# Altium schematic sheet 海关全向控制器主控板电路V2_系统管理.SchDoc
size A4
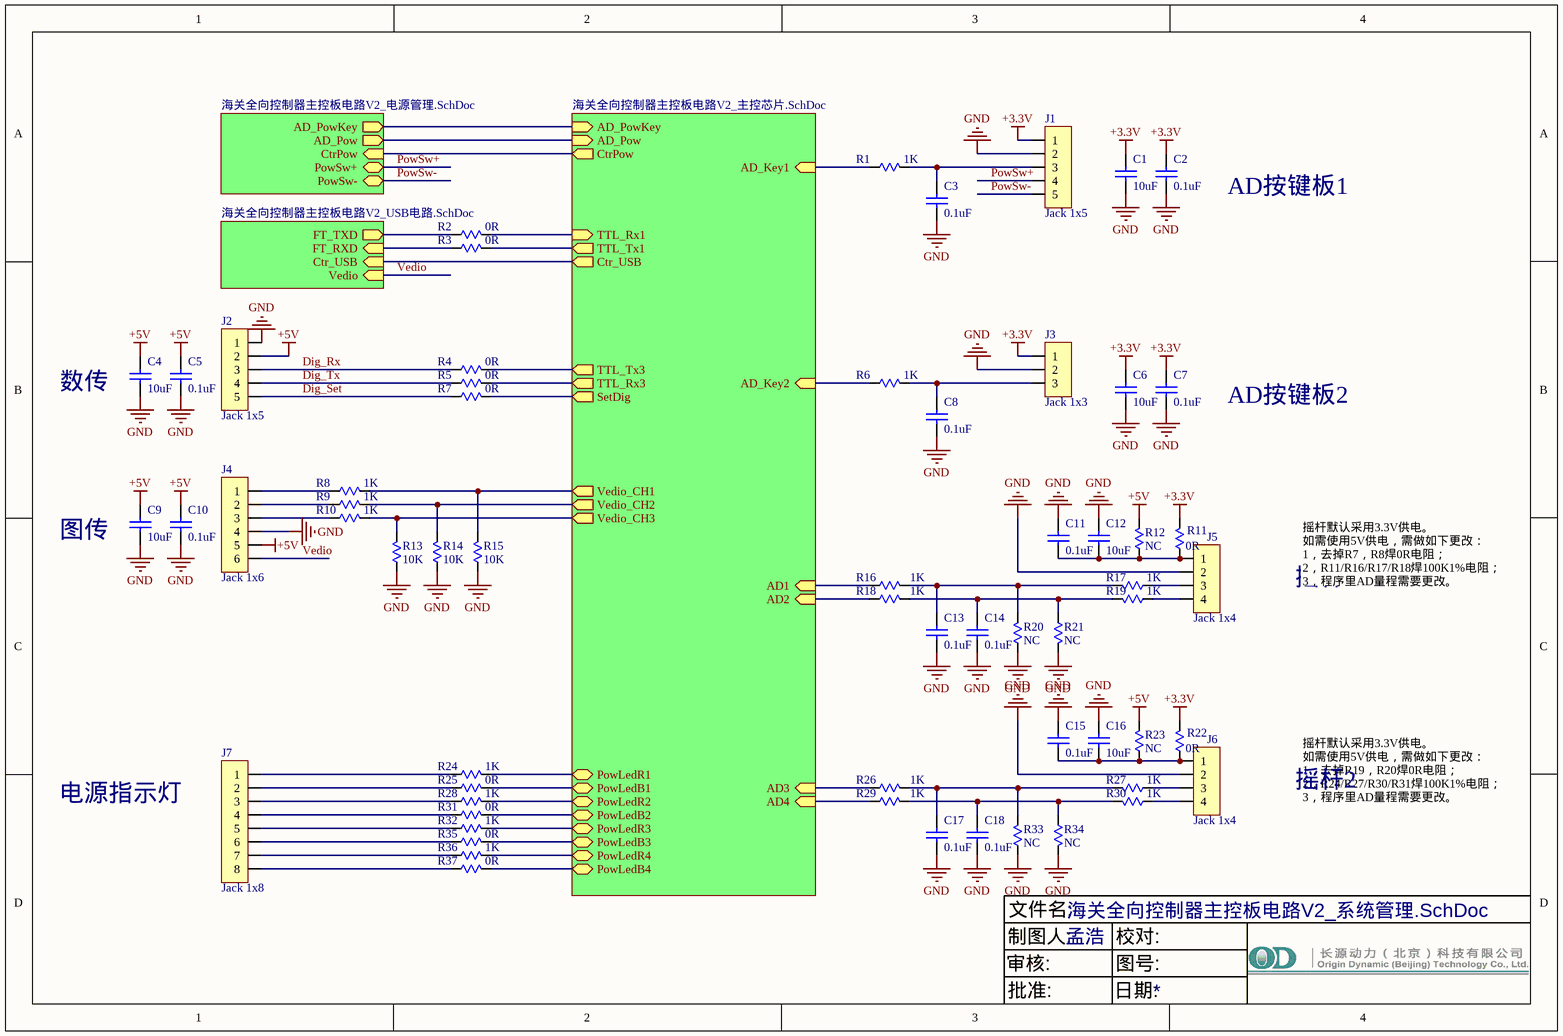
[diagram p0: 海关全向控制器主控板电路V2_系统管理.SchDoc]

## Parts
C1  10uF  [C0603]
C2  0.1uF  [C0603]
C3  0.1uF  [C0603]
C4  10uF  [C0603]
C5  0.1uF  [C0603]
C6  10uF  [C0603]
C7  0.1uF  [C0603]
C8  0.1uF  [C0603]
C9  10uF  [C0603]
C10  0.1uF  [C0603]
C11  0.1uF  [C0603]
C12  10uF  [C0603]
C13  0.1uF  [C0603]
C14  0.1uF  [C0603]
C15  0.1uF  [C0603]
C16  10uF  [C0603]
C17  0.1uF  [C0603]
C18  0.1uF  [C0603]
J1  Jack 1x5  [ZH-5AWD]
J2  Jack 1x5  [ZH-5AWD]
J3  Jack 1x3  [ZH-3AWD]
J4  Jack 1x6  [ZH-6AWD]
J5  Jack 1x4  [ZH-4AWD]
J6  Jack 1x4  [ZH-4AWD]
J7  Jack 1x8  [ZH-8AWD]
R1  1K  [R0603]
R2  0R  [R0603]
R3  0R  [R0603]
R4  0R  [R0603]
R5  0R  [R0603]
R6  1K  [R0603]
R7  0R  [R0603]
R8  1K  [R0603]
R9  1K  [R0603]
R10  1K  [R0603]
R11  0R  [R0603]
R12  NC  [R0603]
R13  10K  [R0603]
R14  10K  [R0603]
R15  10K  [R0603]
R16  1K  [R0603]
R17  1K  [R0603]
R18  1K  [R0603]
R19  1K  [R0603]
R20  NC  [R0603]
R21  NC  [R0603]
R22  0R  [R0603]
R23  NC  [R0603]
R24  1K  [R0603]
R25  0R  [R0603]
R26  1K  [R0603]
R27  1K  [R0603]
R28  1K  [R0603]
R29  1K  [R0603]
R30  1K  [R0603]
R31  0R  [R0603]
R32  1K  [R0603]
R33  NC  [R0603]
R34  NC  [R0603]
R35  0R  [R0603]
R36  1K  [R0603]
R37  0R  [R0603]

## Sub-sheets
Designator = 海关全向控制器主控板电路V2_电源管理.SchDoc: AD_PowKey (out), AD_Pow (out), CtrPow (in), PowSw+ (bidir), PowSw- (bidir)
Designator = 海关全向控制器主控板电路V2_USB电路.SchDoc: FT_RXD (in), FT_TXD (out), Vedio (in), Ctr_USB (in)
Designator = 海关全向控制器主控板电路V2_主控芯片.SchDoc: AD_PowKey (in), AD_Pow (in), CtrPow (out), TTL_Rx1 (in), TTL_Tx1 (out), AD_Key1 (in), AD1 (in), AD2 (in), AD3 (in), AD4 (in), TTL_Tx3 (out), TTL_Rx3 (out), Vedio_CH1 (out), Vedio_CH2 (out), Vedio_CH3 (out), AD_Key2 (in), PowLedR1 (bidir), PowLedR2 (bidir), PowLedR3 (bidir), PowLedB1 (bidir), PowLedB2 (bidir), PowLedB3 (bidir), SetDig (out), Ctr_USB (out), PowLedR4 (bidir), PowLedB4 (bidir)

## Nets
+3.3V: C1.1 C2.1 C6.1 C7.1 J1.1 J3.1 R11.1 R22.1
+5V: C4.1 C5.1 C9.1 C10.1 J2.2 J4.5 R12.1 R23.1
GND: C1.2 C2.2 C3.2 C4.2 C5.2 C6.2 C7.2 C8.2 C9.2 C10.2 C11.1 C12.1 C13.2 C14.2 C15.1 C16.1 C17.2 C18.2 J1.2 J2.1 J3.2 J4.4 J5.2 J6.2 R13.1 R14.1 R15.1 R20.2 R21.1 R33.2 R34.1
Dig_Rx: J2.3 R4.1
Dig_Set: J2.5 R7.1
Dig_Tx: J2.4 R5.1
PowSw+: J1.4 ; sheet Designator/PowSw+
PowSw-: J1.5 ; sheet Designator/PowSw-
Vedio: J4.6 ; sheet Designator/Vedio
NetC3_1: C3.1 J1.3 R1.2
NetC8_1: C8.1 J3.3 R6.2
NetC11_2: C11.2 C12.2 J5.1 R11.2 R12.2
NetC13_1: C13.1 R16.1 R17.1 R20.1
NetC14_1: C14.1 R18.1 R19.1 R21.2
NetC15_2: C15.2 C16.2 J6.1 R22.2 R23.2
NetC17_1: C17.1 R26.1 R27.1 R33.1
NetC18_1: C18.1 R29.1 R30.1 R34.2
NetJ4_1: J4.1 R8.1
NetJ4_2: J4.2 R9.1
NetJ4_3: J4.3 R10.1
NetJ5_3: J5.3 R17.2
NetJ5_4: J5.4 R19.2
NetJ6_3: J6.3 R27.2
NetJ6_4: J6.4 R30.2
NetJ7_1: J7.1 R24.1
NetJ7_2: J7.2 R25.1
NetJ7_3: J7.3 R28.1
NetJ7_4: J7.4 R31.1
NetJ7_5: J7.5 R32.1
NetJ7_6: J7.6 R35.1
NetJ7_7: J7.7 R36.1
NetJ7_8: J7.8 R37.1
NetR1_1: R1.1 ; sheet Designator/AD_Key1
NetR2_1: R2.1 ; sheet Designator/TTL_Rx1
NetR2_2: R2.2 ; sheet Designator/FT_TXD
NetR3_1: R3.1 ; sheet Designator/TTL_Tx1
NetR3_2: R3.2 ; sheet Designator/FT_RXD
NetR4_2: R4.2 ; sheet Designator/TTL_Tx3
NetR5_2: R5.2 ; sheet Designator/TTL_Rx3
NetR6_1: R6.1 ; sheet Designator/AD_Key2
NetR7_2: R7.2 ; sheet Designator/SetDig
NetR8_2: R8.2 R15.2 ; sheet Designator/Vedio_CH1
NetR9_2: R9.2 R14.2 ; sheet Designator/Vedio_CH2
NetR10_2: R10.2 R13.2 ; sheet Designator/Vedio_CH3
NetR16_2: R16.2 ; sheet Designator/AD1
NetR18_2: R18.2 ; sheet Designator/AD2
NetR24_2: R24.2 ; sheet Designator/PowLedR1
NetR25_2: R25.2 ; sheet Designator/PowLedB1
NetR26_2: R26.2 ; sheet Designator/AD3
NetR28_2: R28.2 ; sheet Designator/PowLedR2
NetR29_2: R29.2 ; sheet Designator/AD4
NetR31_2: R31.2 ; sheet Designator/PowLedB2
NetR32_2: R32.2 ; sheet Designator/PowLedR3
NetR35_2: R35.2 ; sheet Designator/PowLedB3
NetR36_2: R36.2 ; sheet Designator/PowLedR4
NetR37_2: R37.2 ; sheet Designator/PowLedB4
(unnamed): sheet Designator/AD_PowKey, sheet Designator/AD_PowKey
(unnamed): sheet Designator/AD_Pow, sheet Designator/AD_Pow
(unnamed): sheet Designator/CtrPow, sheet Designator/CtrPow
(unnamed): sheet Designator/Ctr_USB, sheet Designator/Ctr_USB

## Notes on the sheet
- AD按键板1
- 数传
- AD按键板2
- 图传
- 摇杆默认采用3.3V供电。
  如需使用5V供电，需做如下更改：
  1，去掉R7，R8焊0R电阻；
  2，R11/R16/R17/R18焊100K1%电阻；
  3，程序里AD量程需要更改。
- 摇杆1
- 摇杆2
- 电源指示灯
- 摇杆默认采用3.3V供电。
  如需使用5V供电，需做如下更改：
  1，去掉R19，R20焊0R电阻；
  2，R24/R27/R30/R31焊100K1%电阻；
  3，程序里AD量程需要更改。
- 文件名:
- 审核:
- 制图人:
- 孟浩
- 校对:
- 图号:
- 批准:
- 日期:

## Library data of the parts
C1-C18 = Cap: Capacitor; Published: 8-Jun-2000; Revision: July-2002: Re-released for DXP Platform.; Publisher: Altium Limited
  C1 C4 C6 C9 C12 C16: Value: 10uF
  C2 C3 C5 C7 C8 C10 C11 C13-C15 C17 C18: Value: 0.1uF
J1 J2 = Jack 1x5: 插座
J3 = Jack 1x3: 插座
J4 = Jack 1x6: 插座
J5 J6 = Jack 1x4: 插座
J7 = Jack 1x8: 插座
R1-R37 = Res: Resistor; Published: 8-Jun-2000; LatestRevisionDate: 04-Mar-2005; LatestRevisionNote: PCB Footprint replaced.; PackageReference: J1-0603; Publisher: Altium Limited
  R1 R6 R8-R10 R16-R19 R26 R27 R29 R30: Value: 1K
  R2-R5 R7 R11 R22 R25 R31 R35 R37: Value: 0R
  R12 R20 R21 R23 R33 R34: Value: NC
  R13-R15: Value: 10K